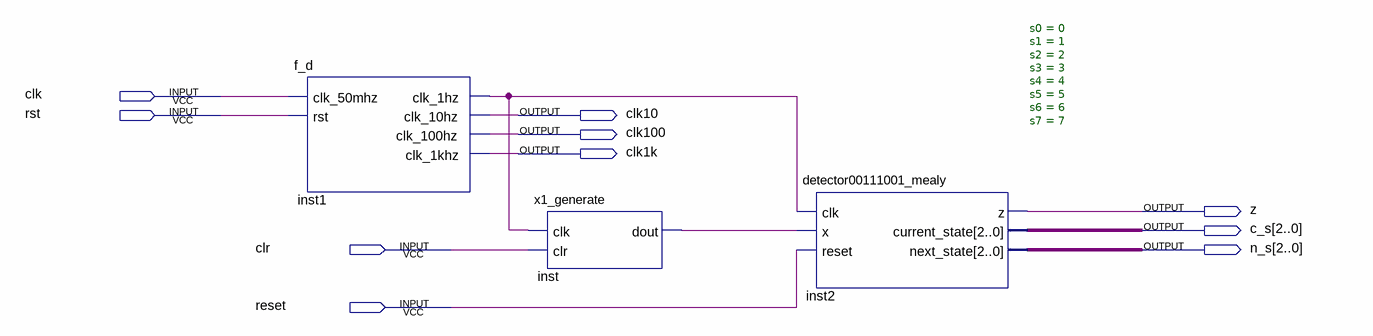
[diagram p0: schematic sheet]
// Quartus schematic test2.bdf as structural Verilog: 3 symbols, 10 pins
module test2 (
  input  clk,
  input  rst,
  input  clr,
  input  reset,
  output clk10,
  output clk100,
  output clk1k,
  output z,
  output [2:0] c_s,
  output [2:0] n_s
);

  wire inst1_clk_1hz, inst_dout;

  f_d inst1 (
    .clk_50mhz(clk), .rst(rst), .clk_1hz(inst1_clk_1hz), .clk_10hz(clk10), .clk_100hz(clk100),
    .clk_1khz(clk1k));
  x1_generate inst (.clk(inst1_clk_1hz), .clr(clr), .dout(inst_dout));
  detector00111001_mealy #(.s0(0), .s1(1), .s2(2), .s3(3), .s4(4), .s5(5), .s6(6), .s7(7)) inst2 (
    .clk(inst1_clk_1hz), .x(inst_dout), .reset(reset), .z(z), .current_state(c_s), .next_state(n_s));
endmodule
